# EAGLE design can tester (1) (EAGLE 9.2.2)
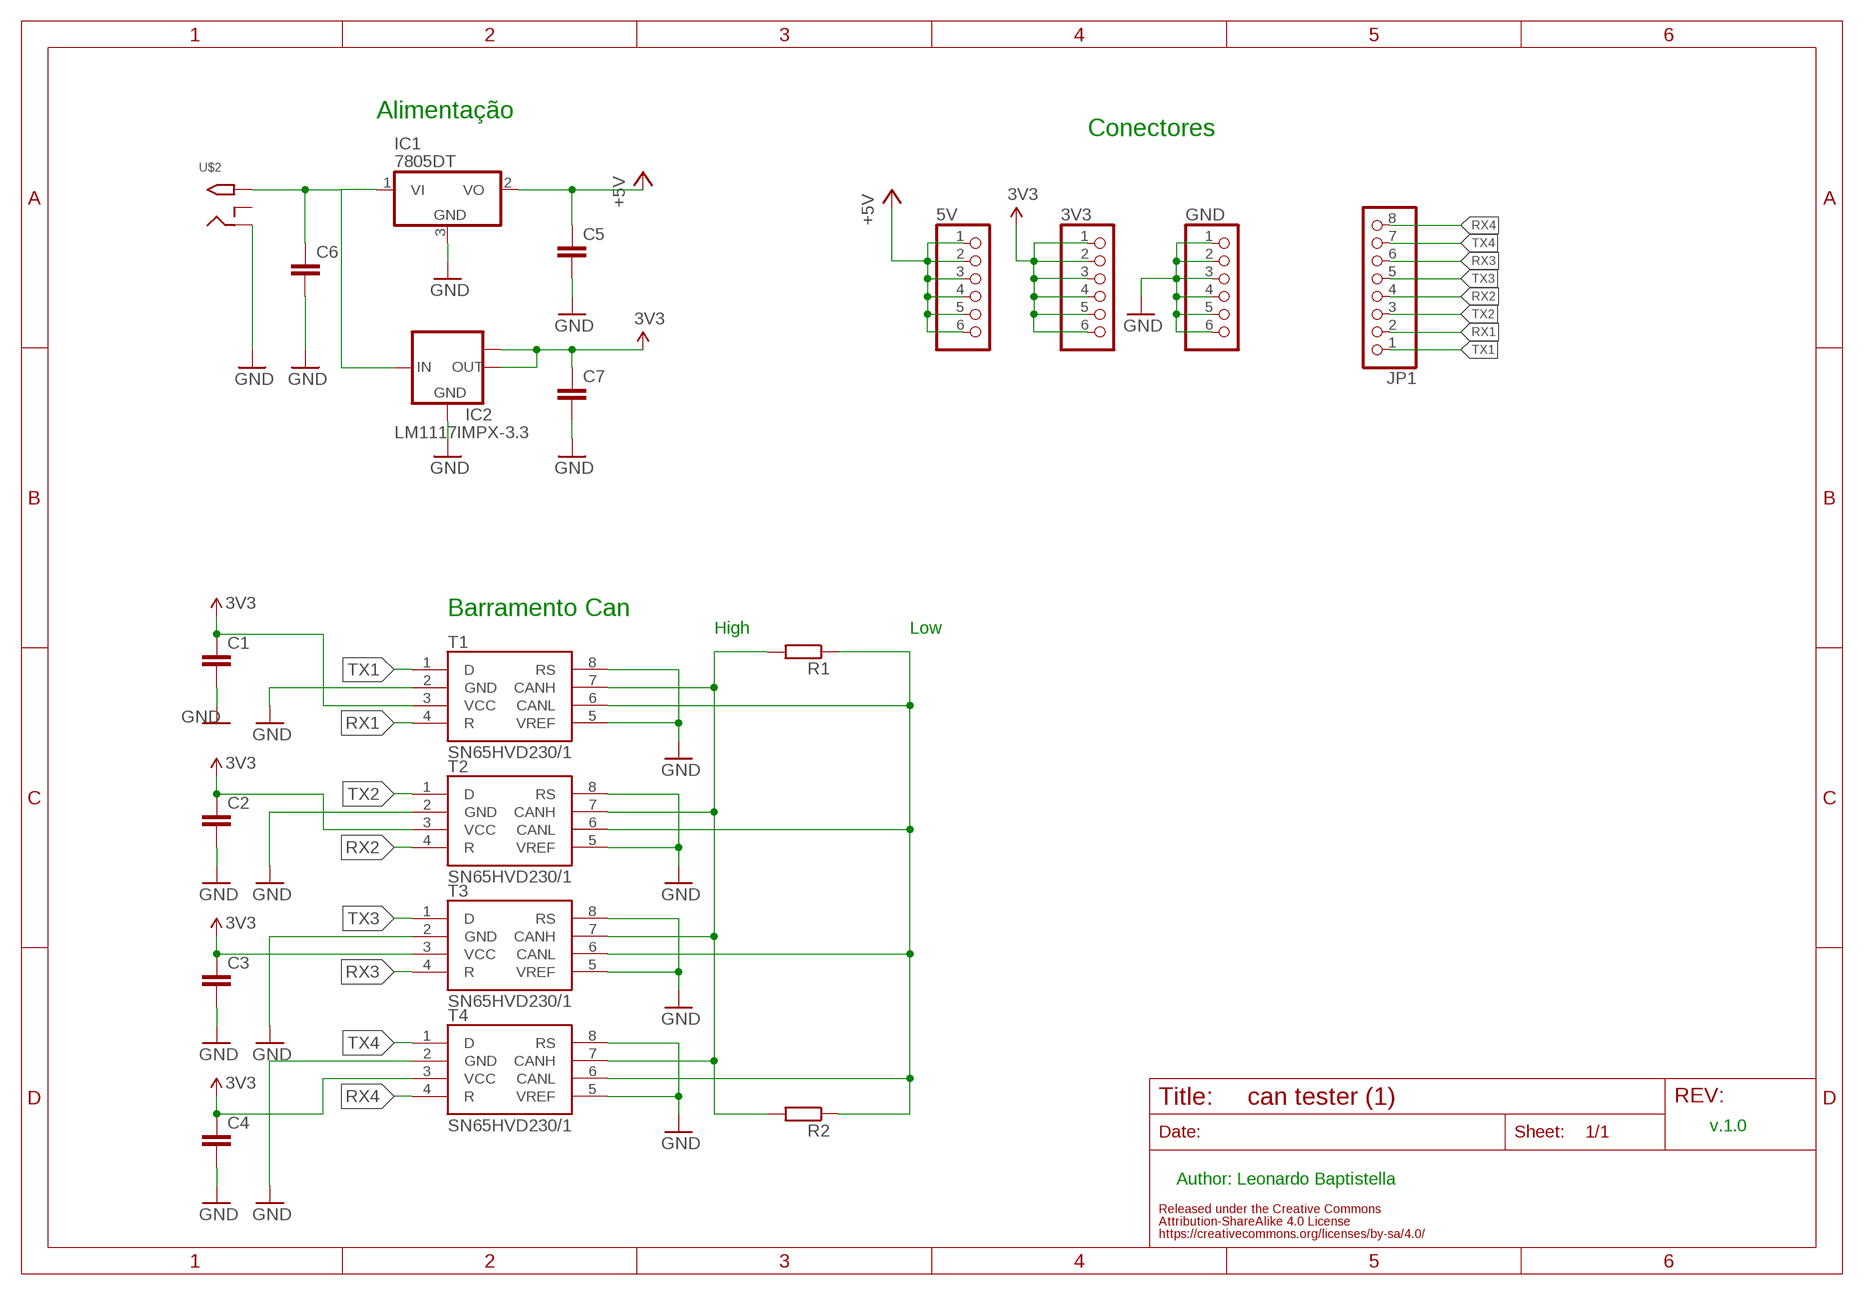
[diagram p0: schematic, sheet 1]

## Parts
3V3  PINHD-1X6B  [1X06-BIG]
5V  PINHD-1X6B  [1X06-BIG]
C1  C-EUC1206K  [C1206K]
C2  C-EUC1206K  [C1206K]
C3  C-EUC1206K  [C1206K]
C4  C-EUC1206K  [C1206K]
C5  C-EUC1206K  [C1206K]
C6  C-EUC1206K  [C1206K]
C7  C-EUC1206K  [C1206K]
GND  PINHD-1X6B  [1X06-BIG]
IC1  7805DT  [TO252]
IC2  LM1117IMPX-3.3  [SOT223]
JP1  PINHD-1X8BIG  [1X08-BIG]
R1  R-EU_0204/7  [0204/7]
R2  R-EU_0204/7  [0204/7]
T1  SN65HVD230/1  [SO8]
T2  SN65HVD230/1  [SO8]
T3  SN65HVD230/1  [SO8]
T4  SN65HVD230/1  [SO8]
U$2  2.1MMJACKTHM  [PJ-102A]

## Nets
3V3: 3V3.1 3V3.2 3V3.3 3V3.4 3V3.5 3V3.6 C1.1 C2.1 C3.1 C4.1 C7.1 IC2.2(OUT) IC2.TAB(OUT1) T1.3(VCC) T2.3(VCC) T3.3(VCC) T4.3(VCC)
+5V: 5V.1 5V.2 5V.3 5V.4 5V.5 5V.6 C5.1 IC1.2(VO)
GND: C1.2 C2.2 C3.2 C4.2 C5.2 C6.2 C7.2 GND.1 GND.2 GND.3 GND.4 GND.5 GND.6 IC1.3(GND) IC2.1(GND) T1.2(GND) T1.5(VREF) T1.8(RS) T2.2(GND) T2.5(VREF) T2.8(RS) T3.2(GND) T3.5(VREF) T3.8(RS) T4.2(GND) T4.5(VREF) T4.8(RS) U$2.RING
N$1: C6.1 IC1.1(VI) IC2.3(IN) U$2.TIP
N$2: R1.1 R2.1 T1.6(CANL) T2.6(CANL) T3.6(CANL) T4.6(CANL)
N$3: R1.2 R2.2 T1.7(CANH) T2.7(CANH) T3.7(CANH) T4.7(CANH)
RX1: JP1.2 T1.4(R)
RX2: JP1.4 T2.4(R)
RX3: JP1.6 T3.4(R)
RX4: JP1.8 T4.4(R)
TX1: JP1.1 T1.1(D)
TX2: JP1.3 T2.1(D)
TX3: JP1.5 T3.1(D)
TX4: JP1.7 T4.1(D)
Unconnected: U$2.RING_SW

## Notes on the sheet
- Alimentação
- Conectores
- Barramento Can
- High | Low
- v.1.0
- Author: Leonardo Baptistella

## Library data of the parts
3V3 5V GND = adafruit:PINHD-1X6: PIN HEADER
C1-C7 = rcl:C-EU: CAPACITOR, European symbol
IC1 = adafruit:78*: Positive VOLTAGE REGULATOR Added bigger pads to the TO-92 package
IC2 = lm1117:LM1117IMPX-*
JP1 = adafruit:PINHD-1X8: PIN HEADER
R1 R2 = rcl:R-EU_: RESISTOR, European symbol
T1-T4 = texas_instruments:SN65HVD230/1
U$2 = adafruit:2.1MMJACK: 2.1mm x 5.5mm THM DC jack with internal switch. Digikey part #PJ-102A, 4UCON part #05537 2.1mm x 5.5mm SMT DC jack with internal switch. Digikey part #PJ-002A-SMT, 4UCON part #03267 By microbuilder.eu & adafruit.com

## Board
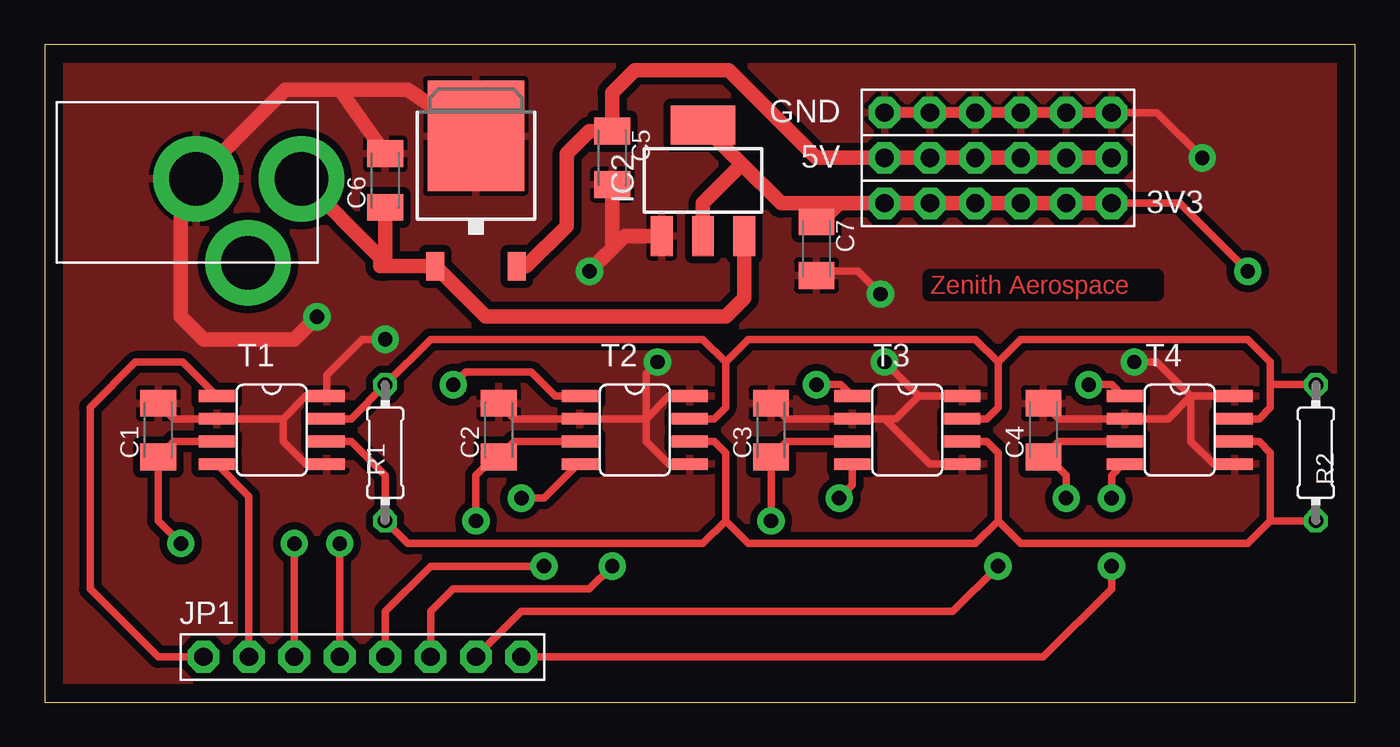
[diagram p1: board, top side]
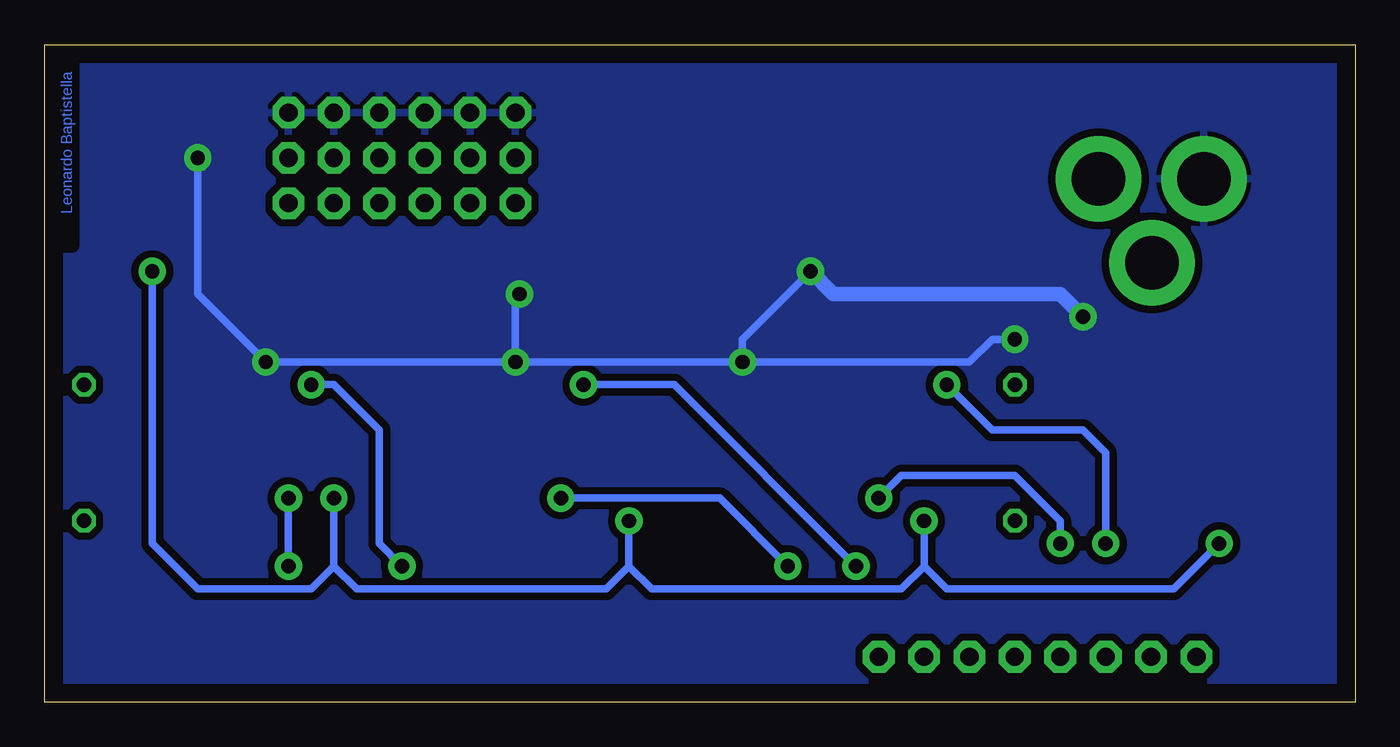
[diagram p2: board, bottom side, seen from below]

Size 73.33 x 36.82 mm. Coordinates in mm from the lower left corner, seen from the top.
Outline: 0,0 73.33,0 73.33,36.82 0,36.82 0,0
Copper layers (1*16): Top 0.035mm / dielectric 1.5mm / Bottom 0.035mm
Design rules "default *": minimum track width 6mil, minimum drill 1mm, track to track 6mil, track to pad 6mil, pad to pad 6mil, via to via 6mil, smd to smd 6mil, copper to edge 40mil, drill to drill 6mil, minimum pad ring 10mil, minimum via ring 8mil, stop-mask expansion 4mil, vias tented up to drill 0mil, thermal gap 10mil

### Footprints (pad centres in the part's own frame; a part is rotated, then mirrored left to right if it is on the bottom)
1X06-BIG = drill 1.016 pad 1.778 octagon: 1 -6.35,0; 2 -3.81,0; 3 -1.27,0; 4 1.27,0; 5 3.81,0; 6 6.35,0
C1206K = smd 1.5 x 2: 1 -1.5,0; 2 1.5,0
TO252 = smd 1 x 1.6: 1 -2.28,-4.8; 2 2.28,-4.8 | smd 5.4 x 6.2: 3 0,2.5
SOT223 = smd 1.219 x 2.235: 1 -2.311,-3.099; 2 0,-3.099; 3 2.311,-3.099 | smd 3.6 x 2.2: TAB 0,3.099
1X08-BIG = drill 1.016 pad 1.778 octagon: 1 -8.89,0; 2 -6.35,0; 3 -3.81,0; 4 -1.27,0; 5 1.27,0; 6 3.81,0; 7 6.35,0; 8 8.89,0
0204/7 = drill 0.813 octagon: 1 -3.81,0; 2 3.81,0
SO8 = smd 0.66 x 2.032: 1 -1.905,-3.073; 2 -0.635,-3.073; 3 0.635,-3.073; 4 1.905,-3.073; 5 1.905,3.073; 6 0.635,3.073; 7 -0.635,3.073; 8 -1.905,3.073
PJ-102A = drill 3 pad 4.8: RING 0.1,-3.39; RING_SW -4.6,-6.29; TIP 0.1,-9.29

### Placement (x,y rotation side)
3V3  53.34,27.94 180 top
5V  53.34,30.48 180 top
C1  6.35,15.24 90 top
C2  25.4,15.24 90 top
C3  40.64,15.24 90 top
C4  55.88,15.24 90 top
C5  31.75,30.48 270 top
C6  19.05,29.21 90 top
C7  43.18,25.4 270 top
GND  53.34,33.02 180 top
IC1  24.13,29.21 0 top
IC2  36.83,29.21 0 top
JP1  17.78,2.54 0 top
R1  19.05,13.97 90 top
R2  71.12,13.97 90 top
T1  12.7,15.24 270 top
T2  33.02,15.24 270 top
T3  48.26,15.24 270 top
T4  63.5,15.24 270 top
U$2  5.08,29.21 90 top

### Tracks (layer width: path | path; a pad name or v marks a point on that pad's centre or on a via)
3V3  (via drill 0.8 pad 1.52)
  Top 0.406: T1.3 7.21,14.61 C1.1 6.35,10.16 v7.62,8.89 | T2.3 26.27,14.61 C2.1 25.17,13.74 24.13,12.7 v24.13,10.16 | T3.3 41.51,14.61 C3.1 v40.64,10.16 | T4.3 56.75,14.61 56,13.86 | 56,13.86 C4.1 | v57.15,11.43 57.15,12.7 56,13.86 | 3V3.1 63.5,27.94 v67.31,24.13
  Top 0.813: 37.19,32.66 IC2.TAB 39.02,30.12 | 3V3.1 3V3.2 3V3.3 3V3.4 3V3.5 3V3.6 44.45,27.94 | C7.1 43.41,26.9 44.45,27.94 | 39.02,30.12 41.2,27.94 44.45,27.94 | IC2.2 36.83,27.94 39.02,30.12
  Bottom 0.406: v7.62,8.89 10.16,6.35 22.86,6.35 24.13,7.62 | 40.64,7.62 39.37,6.35 25.4,6.35 24.13,7.62 | v40.64,10.16 40.64,7.62 | v67.31,24.13 67.31,8.89 64.77,6.35 58.42,6.35 57.15,7.62 | 40.64,7.62 41.91,6.35 55.88,6.35 57.15,7.62 | v57.15,11.43 57.15,7.62 | v24.13,10.16 24.13,7.62
+5V
  Top 0.813: 5V.1 5V.2 5V.3 5V.4 5V.5 5V.6 43.18,30.48 38.26,35.4 33.02,35.4 31.75,34.13 C5.1 30.48,31.98 29.21,30.71 29.21,26.67 26.95,24.41 IC1.2
GND  (via drill 0.8 pad 1.52)
  Top 0.406: C1.2 7.21,15.88 T1.2 13.33,15.88 | C2.2 26.27,15.88 T2.2 33.66,15.88 | C3.2 41.51,15.88 T3.2 46.99,15.88 | C4.2 56.75,15.88 T4.2 62.87,15.88 64.14,17.14 | 13.33,15.88 14.61,17.14 T1.8 15.77,18.31 17.78,20.32 v19.05,20.32 | T2.8 34.93,17.14 33.66,15.88 | 46.99,15.88 47.62,15.88 48.9,17.14 | T3.8 48.9,17.14 | T4.8 64.14,17.14 | v60.96,19.05 62.23,19.05 64.14,17.14 | 48.9,17.14 v46.99,19.05 | v64.77,30.48 62.23,33.02 GND.1 | 13.33,15.88 13.33,14.61 14.61,13.34 T1.5 | 46.99,15.88 49.53,13.34 T3.5 | 64.14,17.14 64.14,14.61 65.41,13.34 T4.5 | v46.77,22.86 45.5,24.13 43.41,24.13 C7.2 | T2.5 34.93,13.34 33.66,14.61 33.66,15.88 | v34.29,19.05 33.66,18.41 33.66,15.88 | 7.62,29.21 7.72,29.31 U$2.RING
  Top 0.61: GND.6 GND.5 GND.4 GND.3 GND.2 GND.1
  Top 0.813: 16.51,34.29 20.32,34.29 IC1.3 | C6.2 16.51,34.29 | C5.2 31.75,25.4 v30.48,24.13 32.46,26.11 IC2.1 | U$2.RING 13.45,34.29 16.51,34.29 | v15.24,21.59 13.97,20.32 8.89,20.32 7.62,21.59 7.62,29.21
  Bottom 0.406: v46.99,19.05 v34.29,19.05 | v34.29,19.05 21.59,19.05 20.32,20.32 v19.05,20.32 | v46.99,19.05 v60.96,19.05 64.77,22.86 v64.77,30.48 | v34.29,19.05 34.29,20.32 v30.48,24.13 | v46.77,22.86 46.99,22.64 v46.99,19.05
  Bottom 0.813: v30.48,24.13 29.21,22.86 16.51,22.86 v15.24,21.59
  pour Top (isolate 0.406): 0,36.83 73.66,36.83 73.66,0 0,0
  pour Bottom (isolate 0.406): 0,36.83 73.66,36.83 73.66,0 0,0
N$1
  Top 0.813: 19.05,24.41 IC1.1 24.67,21.59 38.1,21.59 39.14,22.63 IC2.3 | 19.05,24.41 18.77,24.41 18.77,24.91 U$2.TIP | C6.1 19.05,24.41
N$2
  Top 0.406: T1.6 17.14,14.61 19.05,12.7 R1.1 20.32,8.89 36.83,8.89 38.1,10.16 | T2.6 37.47,14.61 38.1,13.97 38.1,10.16 | T3.6 52.71,14.61 53.34,13.97 53.34,10.16 | T4.6 67.94,14.61 68.58,13.97 68.58,10.16 | 38.1,10.16 39.37,8.89 52.07,8.89 53.34,10.16 | 53.34,10.16 54.61,8.89 67.31,8.89 68.58,10.16 | R2.1 68.58,10.16
N$3
  Top 0.406: T1.7 17.14,15.88 R1.2 21.59,20.32 36.83,20.32 38.1,19.05 | T3.7 52.71,15.88 53.34,16.51 53.34,19.05 | T2.7 37.47,15.88 38.1,16.51 38.1,19.05 | T4.7 67.94,15.88 68.58,16.51 68.58,17.78 | R2.2 68.58,17.78 | 38.1,19.05 39.37,20.32 52.07,20.32 53.34,19.05 | 53.34,19.05 54.61,20.32 67.31,20.32 68.58,19.05 68.58,17.78
RX1
  Top 0.406: T1.4 11.43,11.53 JP1.2
RX2  (via drill 0.8 pad 1.52)
  Top 0.406: v16.51,8.89 JP1.4 | v26.67,11.43 27.94,11.43 29.84,13.34 T2.4
  Bottom 0.406: v16.51,8.89 16.51,10.16 19.05,12.7 25.4,12.7 v26.67,11.43
RX3  (via drill 0.8 pad 1.52)
  Top 0.406: JP1.6 21.59,5.08 22.86,6.35 30.48,6.35 v31.75,7.62 | v44.45,11.43 45.19,12.17 T3.4
  Bottom 0.406: v31.75,7.62 35.56,11.43 v44.45,11.43
RX4  (via drill 0.8 pad 1.52)
  Top 0.406: JP1.8 55.88,2.54 59.69,6.35 v59.69,7.62 | v59.69,11.43 59.69,12.7 60.33,13.34 T4.4
  Bottom 0.406: v59.69,11.43 v59.69,7.62
TX1
  Top 0.406: T1.1 7.72,19.05 5.08,19.05 2.54,16.51 2.54,6.35 6.35,2.54 JP1.1
TX2  (via drill 0.8 pad 1.52)
  Top 0.406: v13.97,8.89 JP1.3 | v22.86,17.78 23.57,18.49 27.23,18.49 28.57,17.14 T2.1
  Bottom 0.406: v13.97,8.89 13.97,13.97 15.24,15.24 20.32,15.24 v22.86,17.78
TX3  (via drill 0.8 pad 1.52)
  Top 0.406: T3.1 44.55,17.78 v43.18,17.78 | v27.94,7.62 21.59,7.62 19.05,5.08 JP1.5
  Bottom 0.406: v43.18,17.78 38.1,17.78 v27.94,7.62
TX4  (via drill 0.8 pad 1.52)
  Top 0.406: JP1.7 26.67,5.08 50.8,5.08 v53.34,7.62 | v58.42,17.78 59.69,17.78 60.33,17.14 T4.1
  Bottom 0.406: v53.34,7.62 54.61,8.89 54.61,15.24 57.15,17.78 v58.42,17.78

### Text on the board
Top: Zenith Aerospace
Bottom: Leonardo Baptistella